# EasyEDA Pro project parallel_trans.eprj

# Schematic Schematic1
Board Name: Board1; Create Date: 2025-04-26; Page Name: P1; Project Name: parallel_trans; Schematic Name: Schematic1; Update Date: 2025-06-30; Company: 嘉立创EDA; Page Size: A4; Version: V1.0
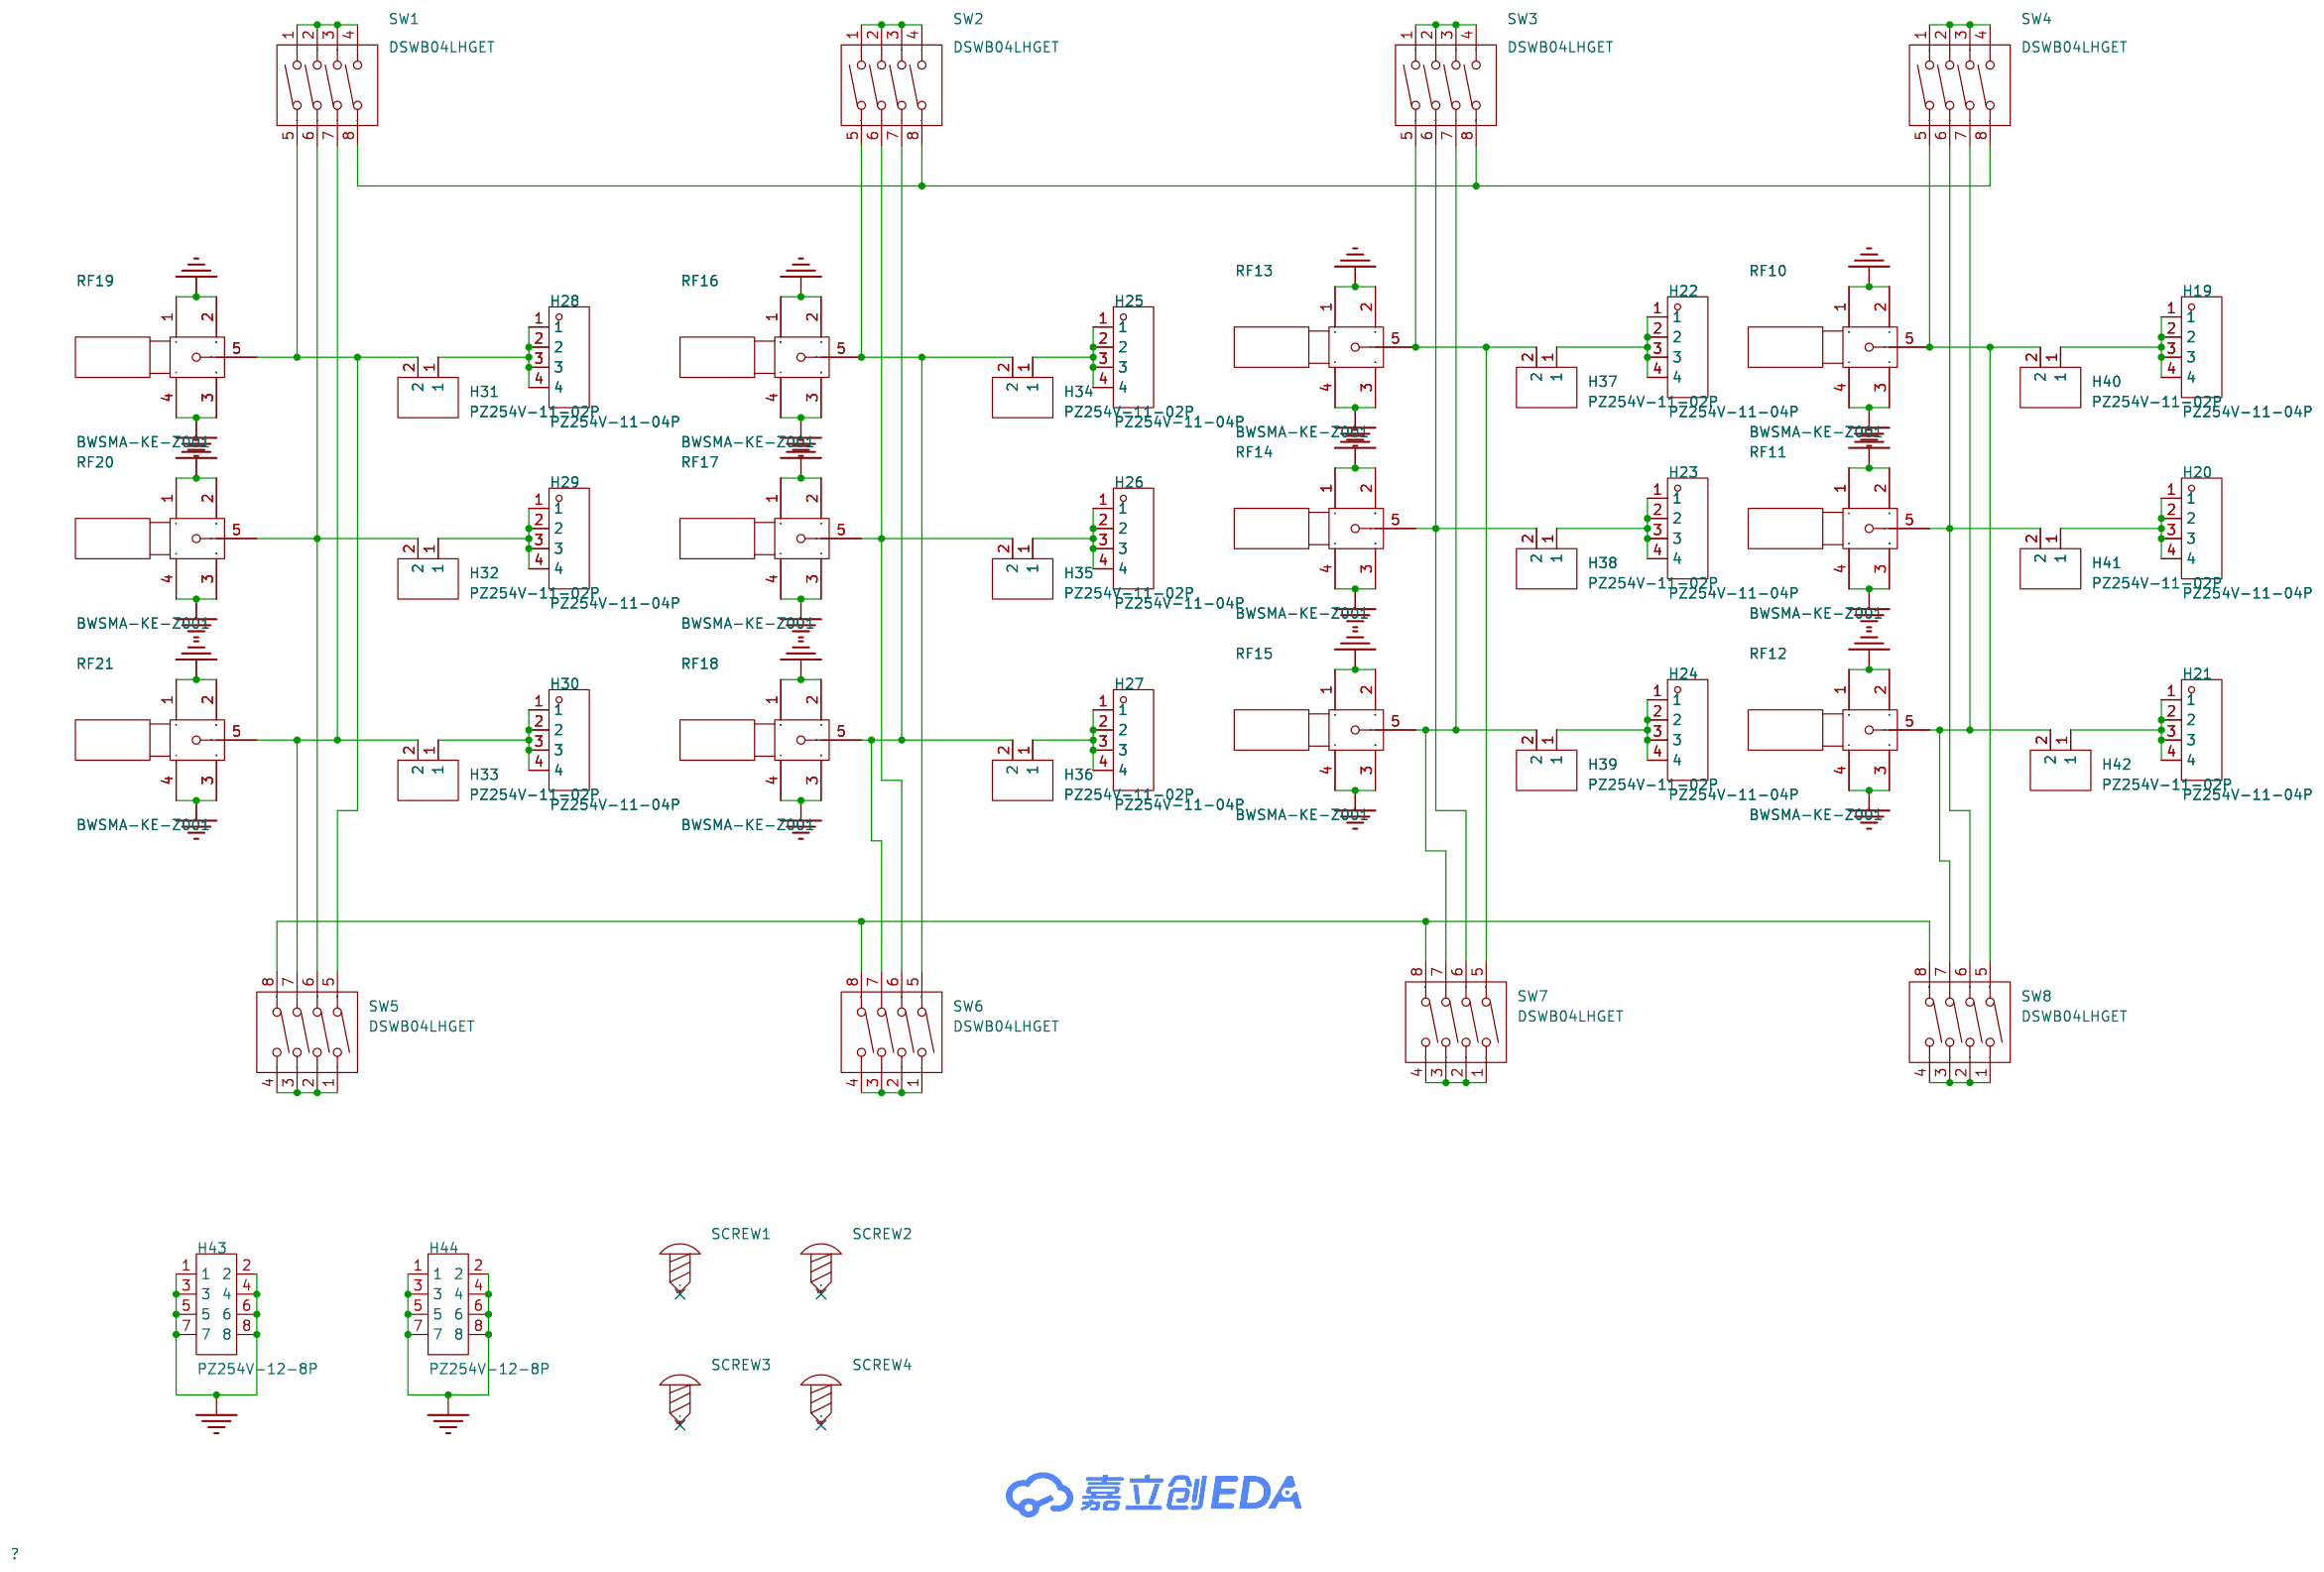
[diagram p0: schematic sheet]

## Parts
H19  PZ254V-11-04P  [HDR-TH_4P-P2.54-V-M]
H20  PZ254V-11-04P  [HDR-TH_4P-P2.54-V-M]
H21  PZ254V-11-04P  [HDR-TH_4P-P2.54-V-M]
H22  PZ254V-11-04P  [HDR-TH_4P-P2.54-V-M]
H23  PZ254V-11-04P  [HDR-TH_4P-P2.54-V-M]
H24  PZ254V-11-04P  [HDR-TH_4P-P2.54-V-M]
H25  PZ254V-11-04P  [HDR-TH_4P-P2.54-V-M]
H26  PZ254V-11-04P  [HDR-TH_4P-P2.54-V-M]
H27  PZ254V-11-04P  [HDR-TH_4P-P2.54-V-M]
H28  PZ254V-11-04P  [HDR-TH_4P-P2.54-V-M]
H29  PZ254V-11-04P  [HDR-TH_4P-P2.54-V-M]
H30  PZ254V-11-04P  [HDR-TH_4P-P2.54-V-M]
H31  PZ254V-11-02P  [HDR-TH_2P-P2.54-V-M]
H32  PZ254V-11-02P  [HDR-TH_2P-P2.54-V-M]
H33  PZ254V-11-02P  [HDR-TH_2P-P2.54-V-M]
H34  PZ254V-11-02P  [HDR-TH_2P-P2.54-V-M]
H35  PZ254V-11-02P  [HDR-TH_2P-P2.54-V-M]
H36  PZ254V-11-02P  [HDR-TH_2P-P2.54-V-M]
H37  PZ254V-11-02P  [HDR-TH_2P-P2.54-V-M]
H38  PZ254V-11-02P  [HDR-TH_2P-P2.54-V-M]
H39  PZ254V-11-02P  [HDR-TH_2P-P2.54-V-M]
H40  PZ254V-11-02P  [HDR-TH_2P-P2.54-V-M]
H41  PZ254V-11-02P  [HDR-TH_2P-P2.54-V-M]
H42  PZ254V-11-02P  [HDR-TH_2P-P2.54-V-M]
H43  PZ254V-12-8P  [HDR-TH_8P-P2.54-V-M-R2-C4-S2.54]
H44  PZ254V-12-8P  [HDR-TH_8P-P2.54-V-M-R2-C4-S2.54]
RF10  BWSMA-KE-Z001  [SMA-TH_BWSMA-KE-Z001]
RF11  BWSMA-KE-Z001  [SMA-TH_BWSMA-KE-Z001]
RF12  BWSMA-KE-Z001  [SMA-TH_BWSMA-KE-Z001]
RF13  BWSMA-KE-Z001  [SMA-TH_BWSMA-KE-Z001]
RF14  BWSMA-KE-Z001  [SMA-TH_BWSMA-KE-Z001]
RF15  BWSMA-KE-Z001  [SMA-TH_BWSMA-KE-Z001]
RF16  BWSMA-KE-Z001  [SMA-TH_BWSMA-KE-Z001]
RF17  BWSMA-KE-Z001  [SMA-TH_BWSMA-KE-Z001]
RF18  BWSMA-KE-Z001  [SMA-TH_BWSMA-KE-Z001]
RF19  BWSMA-KE-Z001  [SMA-TH_BWSMA-KE-Z001]
RF20  BWSMA-KE-Z001  [SMA-TH_BWSMA-KE-Z001]
RF21  BWSMA-KE-Z001  [SMA-TH_BWSMA-KE-Z001]
SCREW1  -  [M3螺丝]
SCREW2  -  [M3螺丝]
SCREW3  -  [M3螺丝]
SCREW4  -  [M3螺丝]
SW1  DSWB04LHGET  [SW-TH_DSWB04LHGET]
SW2  DSWB04LHGET  [SW-TH_DSWB04LHGET]
SW3  DSWB04LHGET  [SW-TH_DSWB04LHGET]
SW4  DSWB04LHGET  [SW-TH_DSWB04LHGET]
SW5  DSWB04LHGET  [SW-TH_DSWB04LHGET]
SW6  DSWB04LHGET  [SW-TH_DSWB04LHGET]
SW7  DSWB04LHGET  [SW-TH_DSWB04LHGET]
SW8  DSWB04LHGET  [SW-TH_DSWB04LHGET]

## Library data of the parts
H19-H30 = PZ254V-11-04P: LCSC Part Name: 间距:2.54mm 1x4P 直插 方针; Supplier Part: C2691448; Manufacturer: XFCN(兴飞); Supplier Footprint: 插件,P=2.54mm; JLCPCB Part Class: 扩展库; Datasheet: https://atta.szlcsc.com/upload/public/pdf/source/20200309/C492403_F9F19131791D08044AD4F84F8E751A34.pdf; Supplier: LCSC; Pin Structure: 1x4P; Pitch: 2.54mm; Circluar Pins/Square Pins: 方针; Mounting Type: 直插; Number of Rows: 单排; Number of Pins: 4P; Current Rating (Max): 3A; Voltage Rating (Max): 250V; Length of Mating Pin: 6mm; Insulation Height: 2.5mm; Length of End Connection Pin: 3mm; Operating Temperature Range: -40℃~+105℃; Color: 黑色
H31-H42 = PZ254V-11-02P: LCSC Part Name: 1x2P 间距:2.54mm 方针 直插; Supplier Part: C492401; Manufacturer: XFCN(兴飞); Supplier Footprint: 插件,P=2.54mm; JLCPCB Part Class: 扩展库; Datasheet: https://atta.szlcsc.com/upload/public/pdf/source/20200309/C492401_A812433581A9B211A7FFA413ADDFF0E5.pdf; Supplier: LCSC; Pin Structure: 1x2P; Pitch: 2.54mm; Circluar Pins/Square Pins: 方针; Mounting Type: 直插; Number of Rows: 单排; Number of Pins: 2P; Length of Mating Pin: 6mm; Insulation Height: 2.5mm; Length of End Connection Pin: 3mm; Contact Material: 黄铜; Operating Temperature: -40℃~+105℃; Color: 黑色
H43 H44 = PZ254V-12-8P: LCSC Part Name: 2x4P 间距:2.54mm 方针 直插; Supplier Part: C492421; Manufacturer: XFCN(兴飞); Supplier Footprint: 插件,P=2.54mm; JLCPCB Part Class: 扩展库; Datasheet: https://atta.szlcsc.com/upload/public/pdf/source/20200309/C492421_DC8A206AF99CD7755BD4A5B0BC48200B.pdf; Supplier: LCSC; Pin Structure: 2x4P; Pitch: 2.54mm; Row Spacing: 2.54mm; Circluar Pins/Square Pins: 方针; Mounting Type: 直插; Number of Rows: 双排; Number of Pins: 8P; Length of Mating Pin: 6mm; Insulation Height: 2.5mm; Length of End Connection Pin: 3mm; Contact Material: 黄铜; Operating Temperature: -40℃~+105℃; Color: 黑色
RF10-RF21 = BWSMA-KE-Z001_C496549: LCSC Part Name: 内孔 SMA 正脚; Supplier Part: C496549; Manufacturer: BAT WIRELESS(蝙蝠无线); Supplier Footprint: 插件; JLCPCB Part Class: 扩展库; Datasheet: https://atta.szlcsc.com/upload/public/pdf/source/20221228/40BF41E56A06003A0210E1785CA66EA6.pdf; Supplier: LCSC; Connector Type: 板端; Interface Type: 内孔; Number of Ports: 1; RF Series: SMA; Impedance: 50Ω; Style: 正脚; Operating Temperature Range: -65℃~+165℃
SCREW1-SCREW4 = M3螺丝: Supplier Footprint: 插件
SW1-SW8 = DSWB04LHGET: LCSC Part Name: 间距2.54mm 平拨,凸起式 4位拨码开关; Supplier Part: C99418; Manufacturer: YE; Supplier Footprint: 插件; JLCPCB Part Class: 扩展库; Datasheet: https://atta.szlcsc.com/upload/public/pdf/source/20220830/02827E67A8727938D957A3CE4C86C92D.pdf; Supplier: LCSC; Type: 平拨,凸起式; Circuit: 单刀单掷; Number of Positions: 4位; Lead Pitch: 2.54mm; Color: 红色

## Nets
GND: H43.1 H43.2 H43.3 H43.4 H43.5 H43.6 H43.7 H43.8 H44.1 H44.2 H44.3 H44.4 H44.5 H44.6 H44.7 H44.8 RF10.1 RF10.2 RF10.3 RF10.4 RF11.1 RF11.2 RF11.3 RF11.4 RF12.1 RF12.2 RF12.3 RF12.4 RF13.1 RF13.2 RF13.3 RF13.4 RF14.1 RF14.2 RF14.3 RF14.4 RF15.1 RF15.2 RF15.3 RF15.4 RF16.1 RF16.2 RF16.3 RF16.4 RF17.1 RF17.2 RF17.3 RF17.4 RF18.1 RF18.2 RF18.3 RF18.4 RF19.1 RF19.2 RF19.3 RF19.4 RF20.1 RF20.2 RF20.3 RF20.4 RF21.1 RF21.2 RF21.3 RF21.4
$1N5094: H31.2 RF19.5 SW1.5 SW5.5
$1N5101: H28.1 H28.2 H28.3 H28.4 H31.1
$1N5308: H21.1 H21.2 H21.3 H21.4 H42.1
$1N5332: H32.2 RF20.5 SW1.6 SW5.6
$1N5339: H29.1 H29.2 H29.3 H29.4 H32.1
$1N5344: H33.2 RF21.5 SW1.7 SW5.7
$1N5351: H30.1 H30.2 H30.3 H30.4 H33.1
$1N5356: H34.2 RF16.5 SW2.5 SW6.5
$1N5363: H25.1 H25.2 H25.3 H25.4 H34.1
$1N5368: H35.2 RF17.5 SW2.6 SW6.6
$1N5375: H26.1 H26.2 H26.3 H26.4 H35.1
$1N5380: H36.2 RF18.5 SW2.7 SW6.7
$1N5387: H27.1 H27.2 H27.3 H27.4 H36.1
$1N5392: H37.2 RF13.5 SW3.5 SW7.5
$1N5399: H22.1 H22.2 H22.3 H22.4 H37.1
$1N5404: H38.2 RF14.5 SW3.6 SW7.6
$1N5411: H23.1 H23.2 H23.3 H23.4 H38.1
$1N5416: H39.2 RF15.5 SW3.7 SW7.7
$1N5423: H24.1 H24.2 H24.3 H24.4 H39.1
$1N5428: H40.2 RF10.5 SW4.5 SW8.5
$1N5435: H19.1 H19.2 H19.3 H19.4 H40.1
$1N5440: H41.2 RF11.5 SW4.6 SW8.6
$1N5447: H20.1 H20.2 H20.3 H20.4 H41.1
$1N5451: H42.2 RF12.5 SW4.7 SW8.7
$1N5611: SW1.1 SW1.2 SW1.3 SW1.4
$1N5632: SW2.1 SW2.2 SW2.3 SW2.4
$1N5654: SW3.1 SW3.2 SW3.3 SW3.4
$1N5702: SW1.8 SW2.8 SW3.8 SW4.8
$1N5734: SW4.1 SW4.2 SW4.3 SW4.4
$1N8243: SW5.1 SW5.2 SW5.3 SW5.4
$1N8264: SW6.1 SW6.2 SW6.3 SW6.4
$1N8286: SW7.1 SW7.2 SW7.3 SW7.4
$1N8697: SW8.1 SW8.2 SW8.3 SW8.4
$1N8799: SW5.8 SW6.8 SW7.8 SW8.8

Not connected (* = marked no-connect by the designer): SCREW1 1*; SCREW2 1*; SCREW3 1*; SCREW4 1*

# Board PCB3
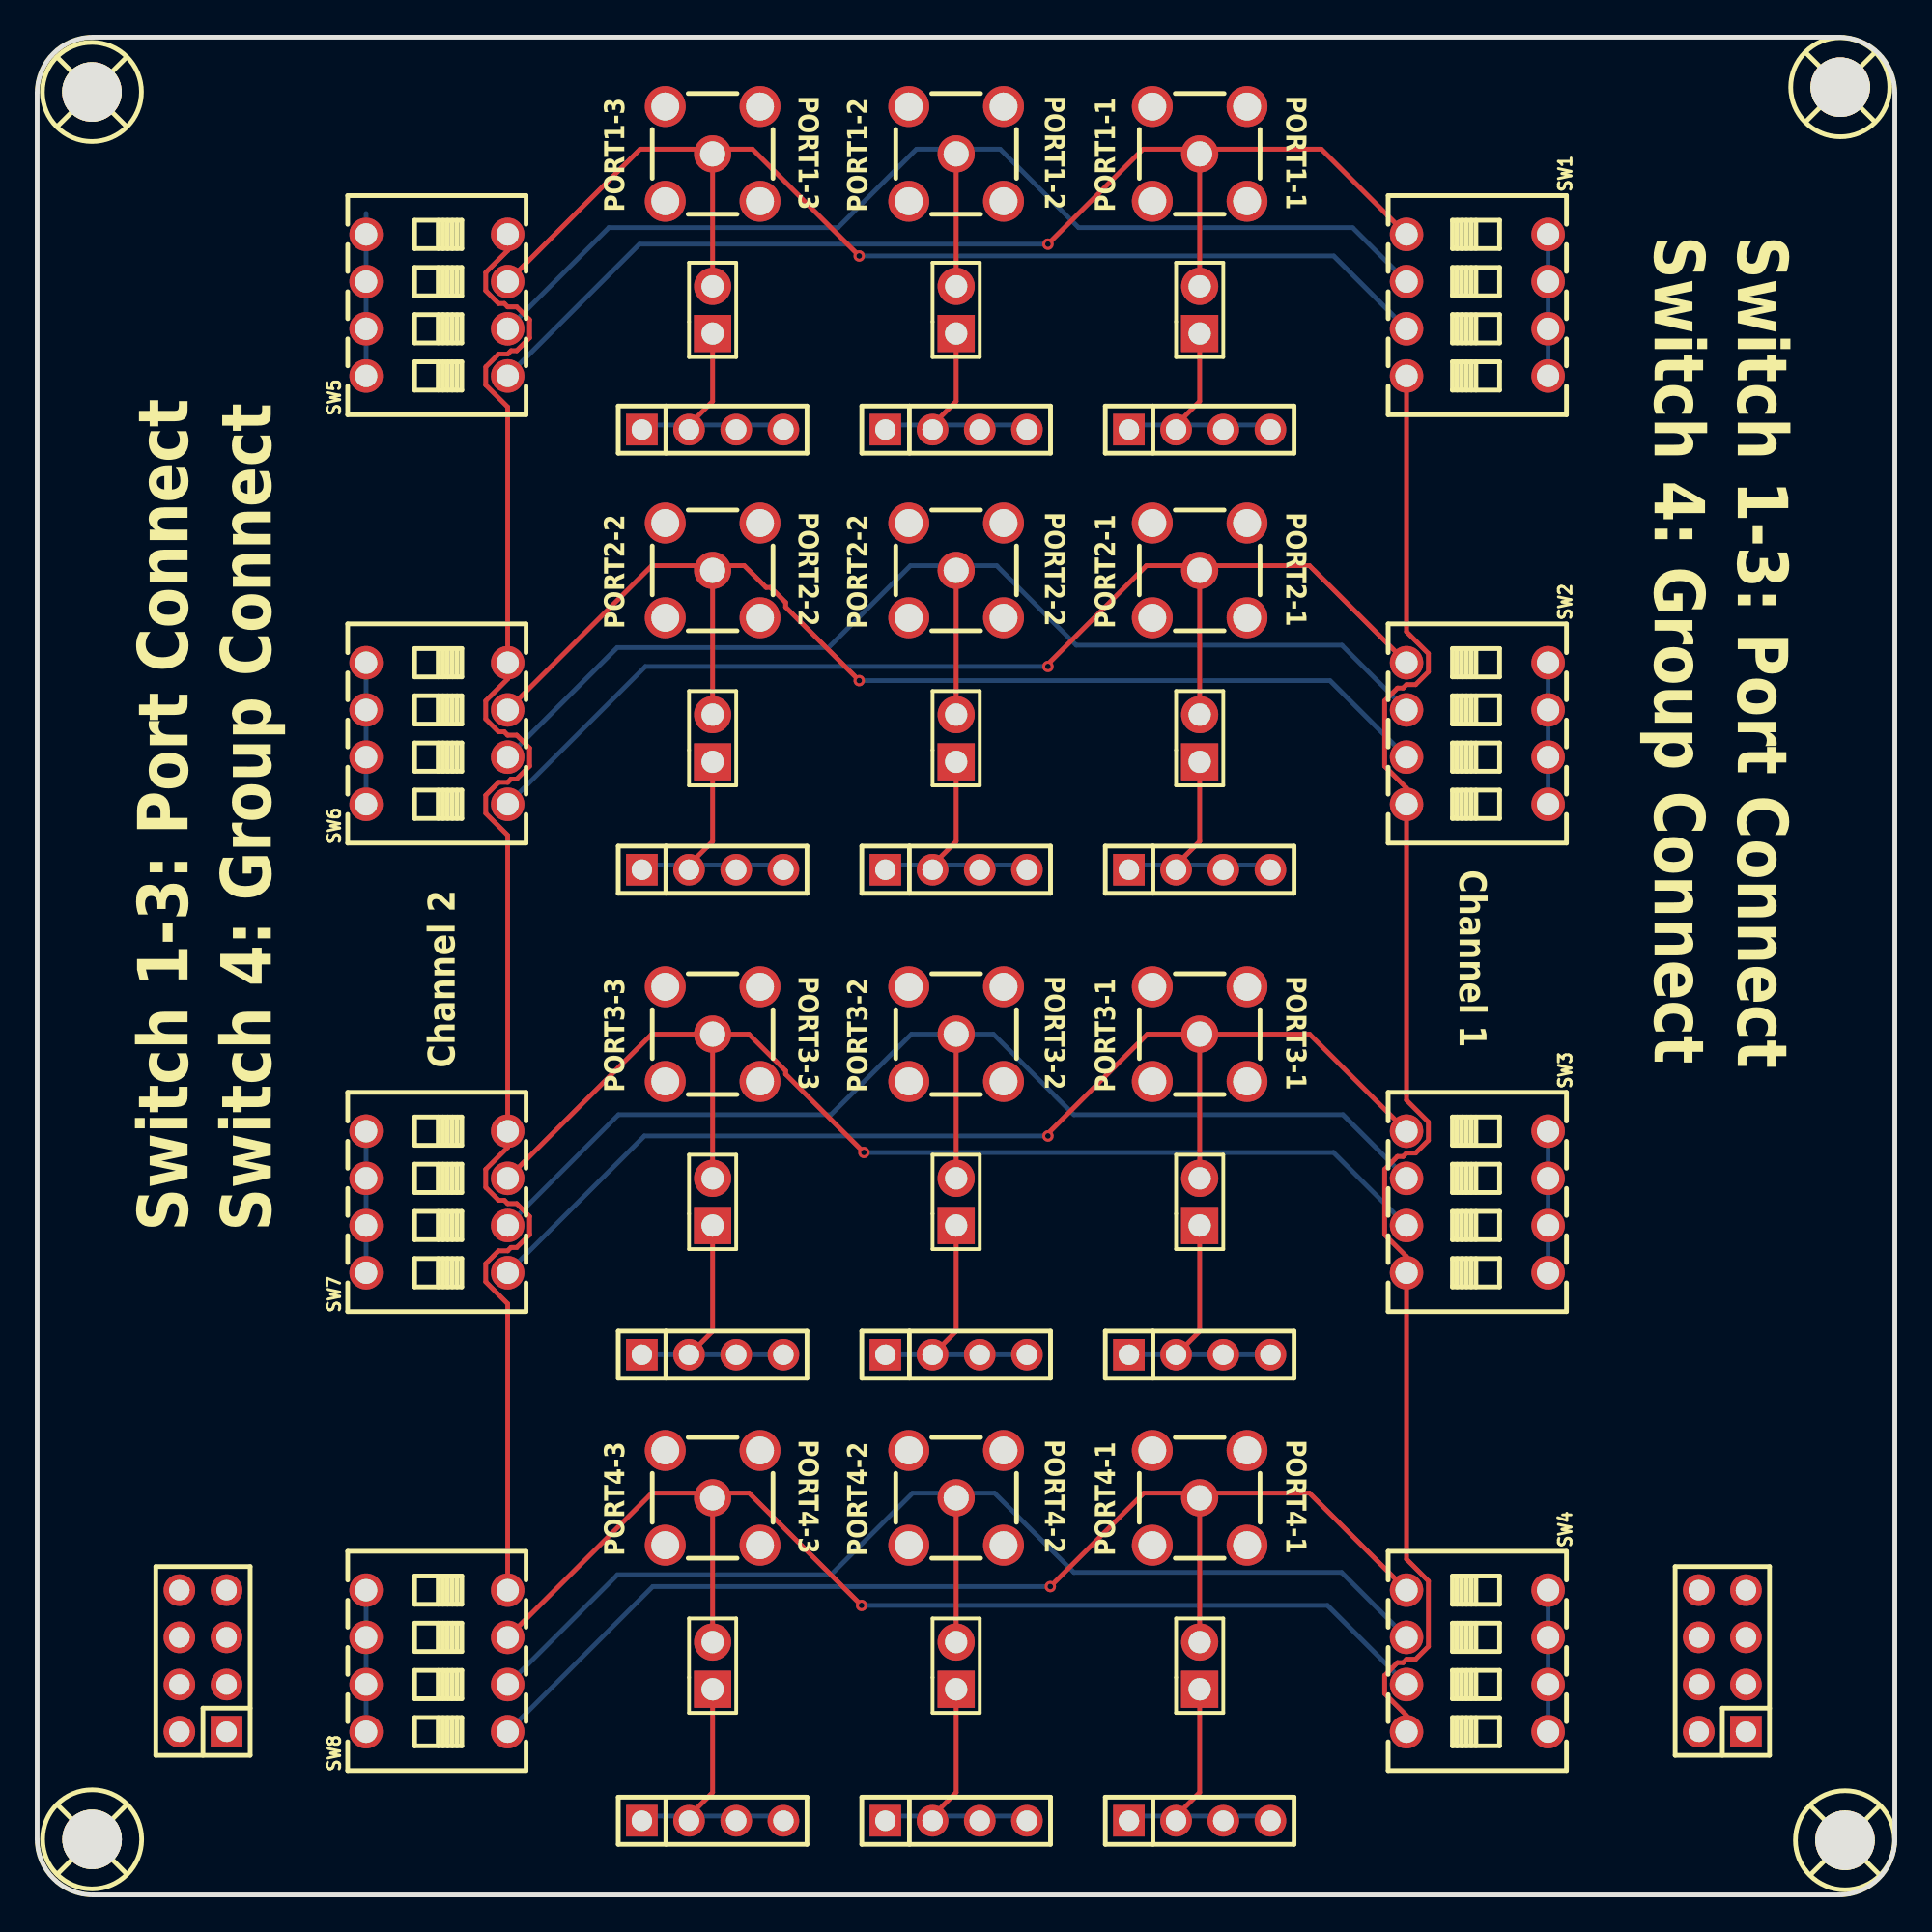
[diagram p1: board, top side]
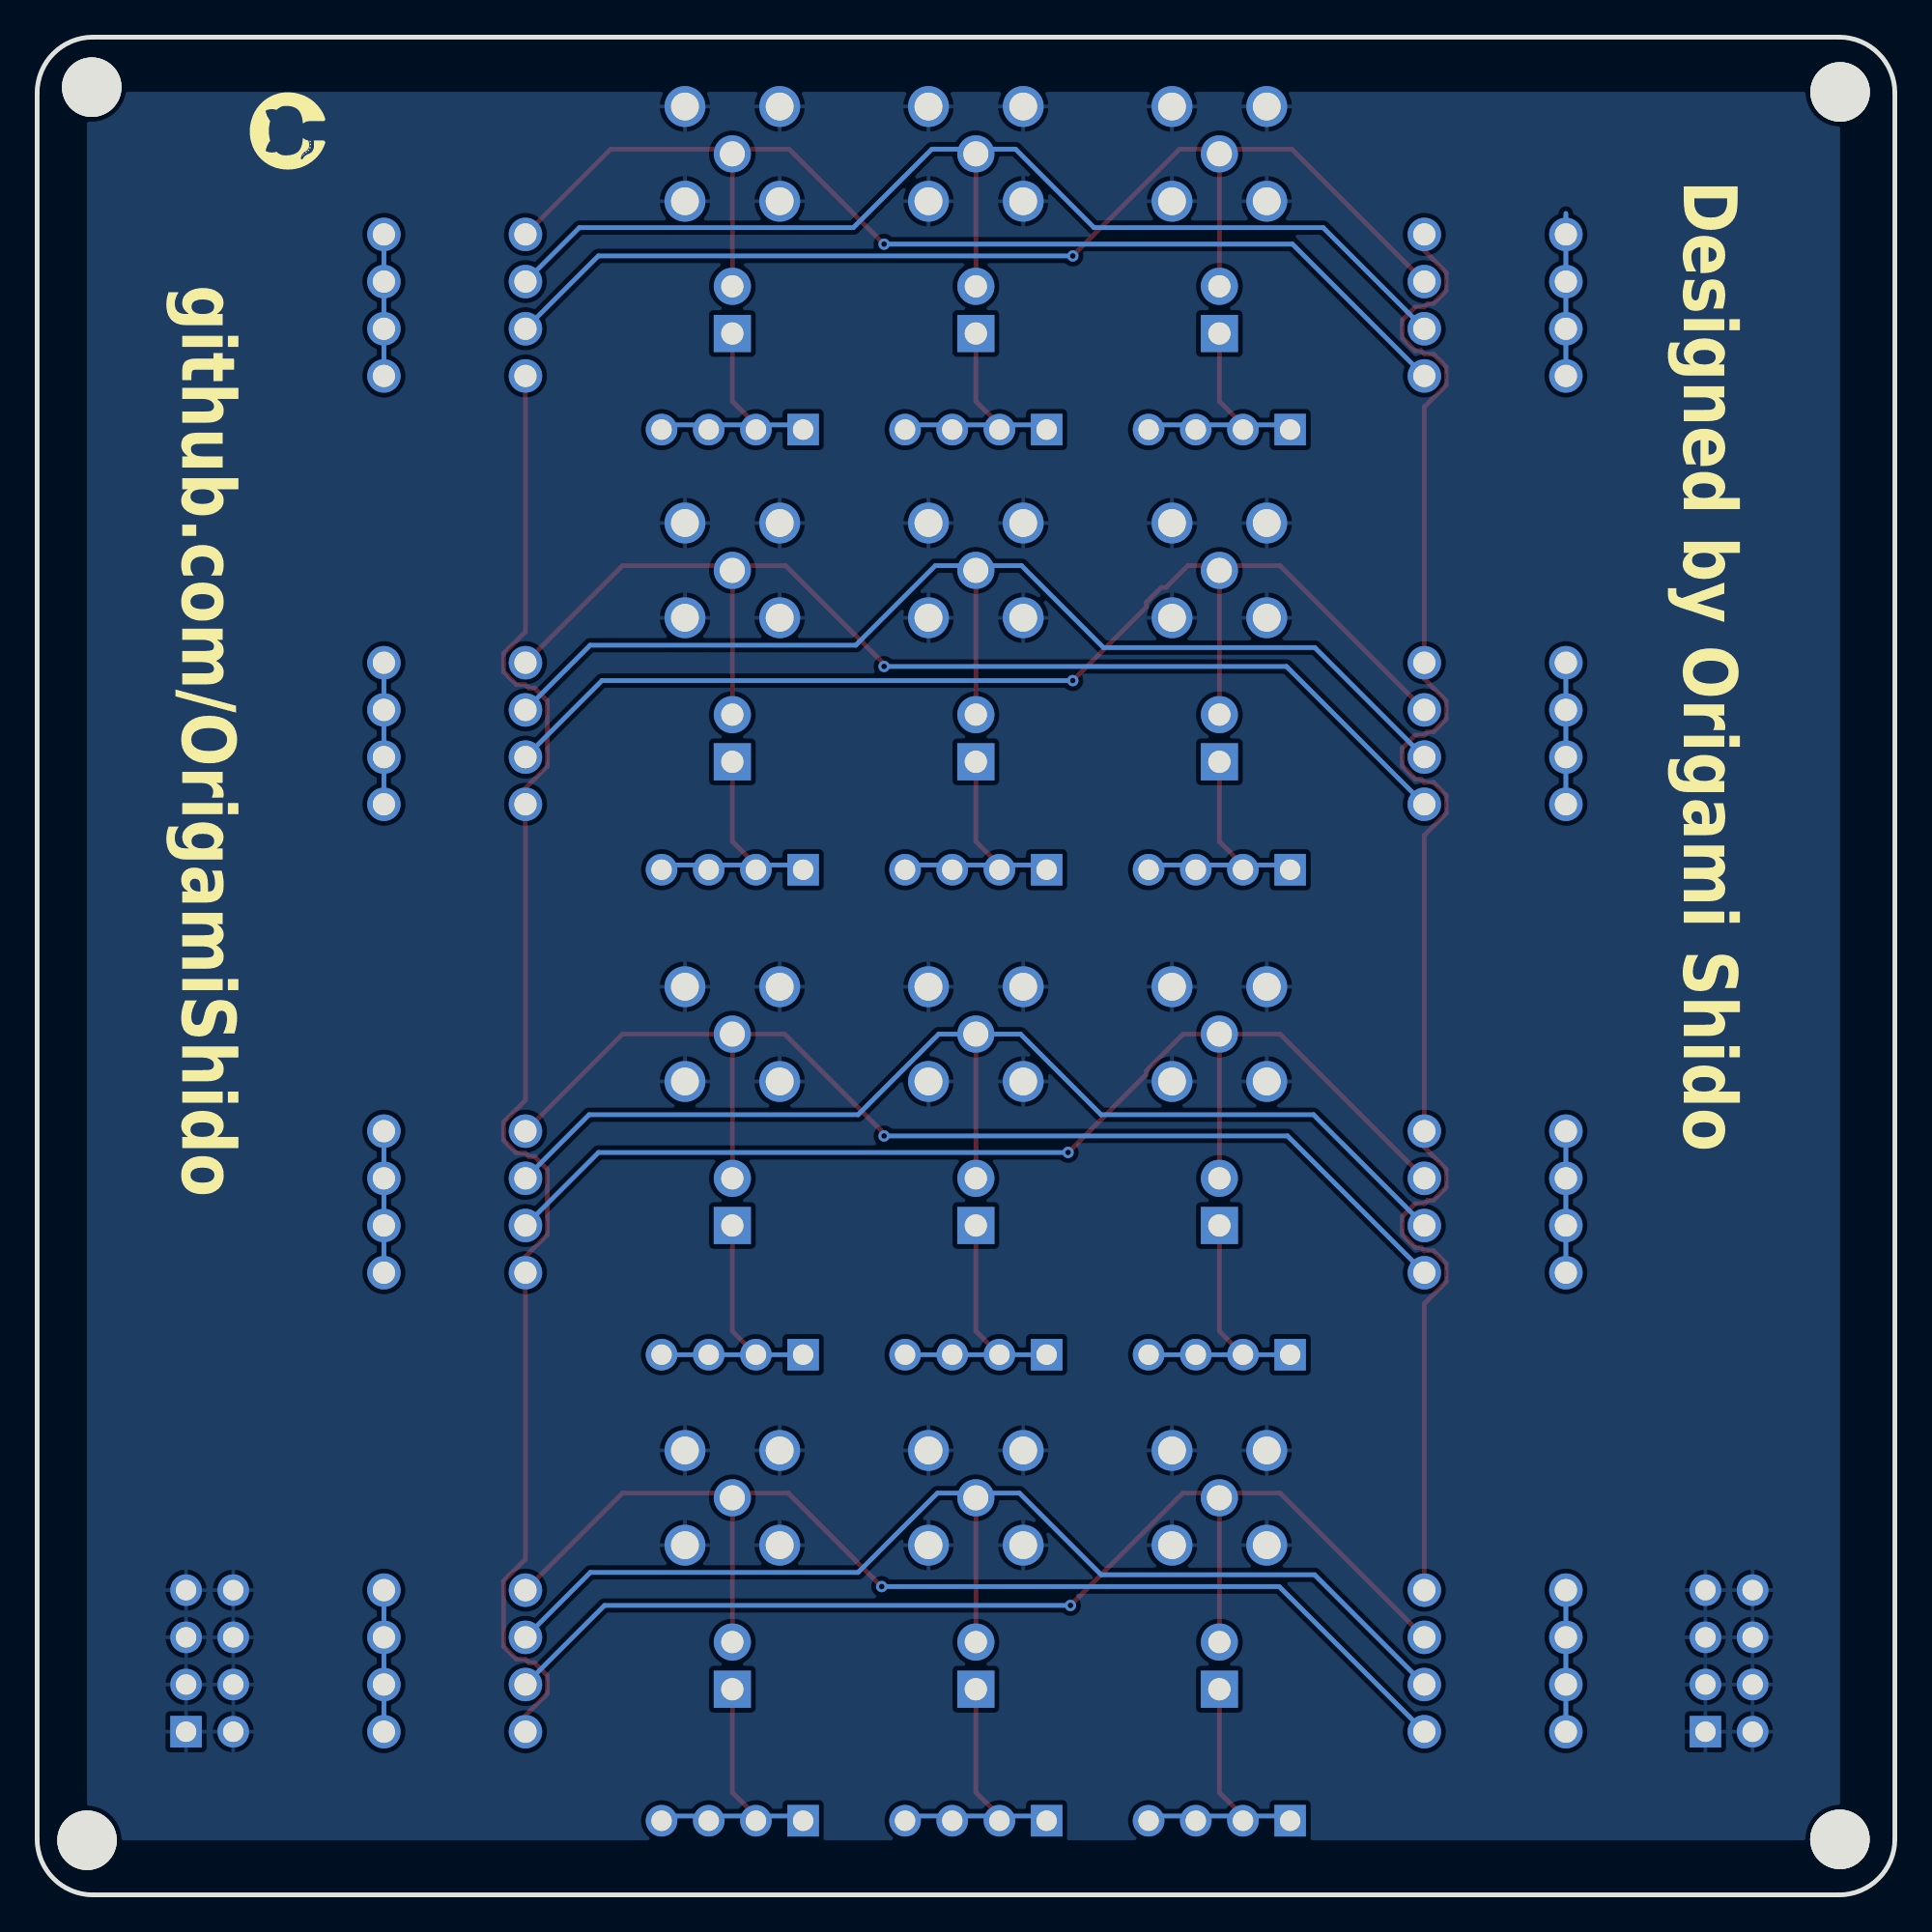
[diagram p2: board, bottom side, seen from below]

Outline 100 x 100 mm; copper layers: Top Layer, Bottom Layer. Coordinates in mm from the lower left corner of the outline.
Outline path: 0,97 0,3 arc(0.88,0.88) 3,0 97,0 arc(99.12,0.88) 100,3 100,97 arc(99.12,99.12) 97,100 3,100 arc(0.88,99.12) 0,97
Stack: Top Layer 0.035mm / Dielectric1 1.51mm FR4 er 4.5 / Bottom Layer 0.035mm

## Design rules (mm)
template: JLCPCB Capability(Two Layers Board)
spacing copperThickness1oz (default): track to track 0.102, other pairs 0.152 to 0.3
spacing copperThickness2oz: track to track 0.203, other pairs 0.152 to 0.3
track width copperThickness1oz (default): min 0.127, default 0.254, max 2.54
track width copperThickness2oz: min 0.203, default 0.254, max 2.54
differential pair differentialPair (default): width min 0.127, default 0.254, max 2.54; gap min 0.152, default 0.152
via viaSize (default): diameter min 0.5, default 0.61, max 10; hole min 0.3, default 0.305, max 6.3

## Placement (name value [footprint] x y rotation side)
H19  PZ254V-11-04P  [HDR-TH_4P-P2.54-V-M]  62.58 3.99 0 top
H20  PZ254V-11-04P  [HDR-TH_4P-P2.54-V-M]  49.47 3.99 0 top
H21  PZ254V-11-04P  [HDR-TH_4P-P2.54-V-M]  36.36 3.99 0 top
H22  PZ254V-11-04P  [HDR-TH_4P-P2.54-V-M]  62.58 29.08 0 top
H23  PZ254V-11-04P  [HDR-TH_4P-P2.54-V-M]  49.47 29.08 0 top
H24  PZ254V-11-04P  [HDR-TH_4P-P2.54-V-M]  36.36 29.08 0 top
H25  PZ254V-11-04P  [HDR-TH_4P-P2.54-V-M]  62.58 55.18 0 top
H26  PZ254V-11-04P  [HDR-TH_4P-P2.54-V-M]  49.47 55.18 0 top
H27  PZ254V-11-04P  [HDR-TH_4P-P2.54-V-M]  36.36 55.18 0 top
H28  PZ254V-11-04P  [HDR-TH_4P-P2.54-V-M]  62.58 78.87 0 top
H29  PZ254V-11-04P  [HDR-TH_4P-P2.54-V-M]  49.47 78.87 0 top
H30  PZ254V-11-04P  [HDR-TH_4P-P2.54-V-M]  36.36 78.87 0 top
H31  PZ254V-11-02P  [HDR-TH_2P-P2.54-V-M]  62.58 85.32 90 top
H32  PZ254V-11-02P  [HDR-TH_2P-P2.54-V-M]  49.47 85.32 90 top
H33  PZ254V-11-02P  [HDR-TH_2P-P2.54-V-M]  36.36 85.32 90 top
H34  PZ254V-11-02P  [HDR-TH_2P-P2.54-V-M]  62.58 62.26 90 top
H35  PZ254V-11-02P  [HDR-TH_2P-P2.54-V-M]  49.47 62.26 90 top
H36  PZ254V-11-02P  [HDR-TH_2P-P2.54-V-M]  36.36 62.26 90 top
H37  PZ254V-11-02P  [HDR-TH_2P-P2.54-V-M]  62.58 37.3 90 top
H38  PZ254V-11-02P  [HDR-TH_2P-P2.54-V-M]  49.47 37.3 90 top
H39  PZ254V-11-02P  [HDR-TH_2P-P2.54-V-M]  36.36 37.3 90 top
H40  PZ254V-11-02P  [HDR-TH_2P-P2.54-V-M]  62.58 12.34 90 top
H41  PZ254V-11-02P  [HDR-TH_2P-P2.54-V-M]  49.47 12.34 90 top
H42  PZ254V-11-02P  [HDR-TH_2P-P2.54-V-M]  36.36 12.34 90 top
H43  PZ254V-12-8P  [HDR-TH_8P-P2.54-V-M-R2-C4-S2.54]  90.71 12.59 90 top
H44  PZ254V-12-8P  [HDR-TH_8P-P2.54-V-M-R2-C4-S2.54]  8.93 12.59 90 top
RF10  BWSMA-KE-Z001  [SMA-TH_BWSMA-KE-Z001]  62.58 21.37 270 top
RF11  BWSMA-KE-Z001  [SMA-TH_BWSMA-KE-Z001]  49.47 21.37 270 top
RF12  BWSMA-KE-Z001  [SMA-TH_BWSMA-KE-Z001]  36.36 21.37 270 top
RF13  BWSMA-KE-Z001  [SMA-TH_BWSMA-KE-Z001]  62.58 46.33 270 top
RF14  BWSMA-KE-Z001  [SMA-TH_BWSMA-KE-Z001]  49.47 46.33 270 top
RF15  BWSMA-KE-Z001  [SMA-TH_BWSMA-KE-Z001]  36.36 46.33 270 top
RF16  BWSMA-KE-Z001  [SMA-TH_BWSMA-KE-Z001]  62.58 71.3 270 top
RF17  BWSMA-KE-Z001  [SMA-TH_BWSMA-KE-Z001]  49.47 71.3 270 top
RF18  BWSMA-KE-Z001  [SMA-TH_BWSMA-KE-Z001]  36.36 71.3 270 top
RF19  BWSMA-KE-Z001  [SMA-TH_BWSMA-KE-Z001]  62.58 93.72 270 top
RF20  BWSMA-KE-Z001  [SMA-TH_BWSMA-KE-Z001]  49.47 93.72 270 top
RF21  BWSMA-KE-Z001  [SMA-TH_BWSMA-KE-Z001]  36.36 93.72 270 top
SCREW1  -  [M3螺丝]  2.96 2.99 0 top
SCREW2  -  [M3螺丝]  97.32 2.94 0 top
SCREW3  -  [M3螺丝]  97.06 97.31 0 top
SCREW4  -  [M3螺丝]  2.95 97.05 0 top
SW1  DSWB04LHGET  [SW-TH_DSWB04LHGET]  77.52 85.57 270 top
SW2  DSWB04LHGET  [SW-TH_DSWB04LHGET]  77.52 62.52 270 top
SW3  DSWB04LHGET  [SW-TH_DSWB04LHGET]  77.52 37.3 270 top
SW4  DSWB04LHGET  [SW-TH_DSWB04LHGET]  77.52 12.59 270 top
SW5  DSWB04LHGET  [SW-TH_DSWB04LHGET]  21.52 85.57 90 top
SW6  DSWB04LHGET  [SW-TH_DSWB04LHGET]  21.52 62.52 90 top
SW7  DSWB04LHGET  [SW-TH_DSWB04LHGET]  21.52 37.3 90 top
SW8  DSWB04LHGET  [SW-TH_DSWB04LHGET]  21.52 12.59 90 top

## Footprints (pads in the part's own frame, mm; a bottom-side part is the same pattern mirrored in y, then rotated)
HDR-TH_2P-P2.54-V-M
  rect 2x2 hole 1.2: 1(-1.27,0)
  round 2 hole 1.2: 2(1.27,0)
HDR-TH_4P-P2.54-V-M
  rect 1.7x1.7 hole 1.1: 1(-3.81,0)
  round 1.7 hole 1.1: 2(-1.27,0) 3(1.27,0) 4(3.81,0)
HDR-TH_8P-P2.54-V-M-R2-C4-S2.54
  rect 1.7x1.7 hole 1.1: 1(-3.81,-1.27)
  round 1.7 hole 1.1: 2(-3.81,1.27) 3(-1.27,-1.27) 4(-1.27,1.27) 5(1.27,-1.27) 6(1.27,1.27) 7(3.81,-1.27) 8(3.81,1.27)
M3螺丝
  round 3.2 hole 3.2: 1(0,0)
SMA-TH_BWSMA-KE-Z001
  round 2.2 hole 1.5: 1(-2.55,-2.55) 2(-2.55,2.55) 3(2.55,2.55) 4(2.55,-2.55)
  round 2 hole 1.35: 5(0,0)
SW-TH_DSWB04LHGET
  round 1.8 hole 1.2: 1(-3.81,3.81) 2(-1.27,3.81) 3(1.27,3.81) 4(3.81,3.81) 5(-3.81,-3.81) 6(-1.27,-3.81) 7(1.27,-3.81) 8(3.81,-3.81)

## Nets
As in the schematic.

Pads without a net: SCREW1 1; SCREW2 1; SCREW3 1; SCREW4 1

## Via types
v1: diameter 0.61, hole 0.305, Top Layer to Bottom Layer, 8 vias

## Routing (per net, layer and track width the routed paths; a pad name or vN(x,y) marks a point on that pad's centre or on a via; arc(x,y) is an arc through that point)
$1N5094: length 62.5
  Top Layer w0.254: 62.58,93.97 69.13,93.97 SW1.5 ; 62.58,93.97 62.58,86.84 ; 62.58,93.97 59.52,93.97 v1(54.41,88.86)
  Bottom Layer w0.254: SW5.5 32.42,88.86 v1(54.41,88.86)
$1N5101: length 13.3
  Top Layer w0.254: 62.58,84.3 62.58,80.4 61.31,79.13
  Bottom Layer w0.254: 66.39,79.13 58.77,79.13
$1N5308: length 15.2
  Top Layer w0.254: 35.09,4.24 36.36,5.51 36.36,11.32
  Bottom Layer w0.254: 40.17,4.24 32.55,4.24
$1N5332: length 62.5
  Top Layer w0.254: 49.47,93.97 49.47,86.84
  Bottom Layer w0.254: SW1.6 70.81,89.75 56.06,89.75 51.84,93.97 47.33,93.97 43.11,89.75 30.77,89.75 SW5.6
$1N5339: length 13.3
  Top Layer w0.254: 48.2,79.13 49.47,80.4 49.47,84.3
  Bottom Layer w0.254: 53.28,79.13 45.66,79.13
$1N5344: length 62.5
  Top Layer w0.254: v1(44.25,88.22) 38.5,93.97 36.36,93.97 ; 36.36,93.97 36.36,86.84 ; 36.36,93.97 32.46,93.97 SW5.7
  Bottom Layer w0.254: SW1.7 69.79,88.22 v1(44.25,88.22)
$1N5351: length 13.3
  Top Layer w0.254: 36.36,84.3 36.36,80.4 35.09,79.13
  Bottom Layer w0.254: 40.17,79.13 32.55,79.13
$1N5356: length 63.6
  Top Layer w0.254: 62.58,71.55 59.71,71.55 54.28,66.12 ; 62.58,71.55 62.58,63.79 ; 62.58,71.55 68.49,71.55 SW2.5
  Bottom Layer w0.254: 54.28,66.12 32.75,66.12 SW6.5
  vias: v1(54.41,66.12)
$1N5363: length 14
  Top Layer w0.254: 62.58,61.25 62.58,56.71 61.31,55.44
  Bottom Layer w0.254: 66.39,55.44 58.77,55.44
$1N5368: length 63.6
  Top Layer w0.254: 49.47,71.55 49.47,63.79
  Bottom Layer w0.254: SW6.6 31.22,67.14 42.6,67.14 47.01,71.55 51.65,71.55 55.93,67.27 70.23,67.27 SW2.6
$1N5375: length 14
  Top Layer w0.254: 49.47,61.25 49.47,56.71 48.2,55.44
  Bottom Layer w0.254: 53.28,55.44 45.66,55.44
$1N5380: length 63.8
  Top Layer w0.254: 36.36,71.55 38.06,71.55 39.24,70.38 39.48,70.38 40.29,69.57 40.29,69.32 v1(44.25,65.36) ; 36.36,71.55 36.36,63.79 ; 36.36,71.55 33.09,71.55 SW6.7
  Bottom Layer w0.254: v1(44.25,65.36) 69.6,65.36 SW2.7
$1N5387: length 14
  Top Layer w0.254: 36.36,61.25 36.36,56.71 35.09,55.44
  Bottom Layer w0.254: 40.17,55.44 32.55,55.44
$1N5392: length 63.6
  Top Layer w0.254: RF13.5 H37.2 ; RF13.5 68.49,46.33 SW3.5 ; RF13.5 59.77,46.33 54.28,40.85
  Bottom Layer w0.254: SW7.5 32.69,40.85 54.28,40.85
  vias: v1(54.41,40.85)
$1N5399: length 15.1
  Top Layer w0.254: H22.2 62.58,30.35 H37.1
  Bottom Layer w0.254: H22.1 H22.2 H22.3 H22.4
$1N5404: length 63.6
  Top Layer w0.254: RF14.5 H38.2
  Bottom Layer w0.254: SW7.6 31.29,41.99 42.73,41.99 47.07,46.33 RF14.5 51.47,46.33 55.81,41.99 70.29,41.99 SW3.6
$1N5411: length 15.1
  Top Layer w0.254: H38.1 49.47,30.35 H23.2
  Bottom Layer w0.254: H23.1 H23.2 H23.3 H23.4
$1N5416: length 63.7
  Top Layer w0.254: SW7.7 33.09,46.33 RF15.5 ; RF15.5 38.31,46.33 40.29,44.35 40.29,44.18 v1(44.51,39.96) ; RF15.5 H39.2
  Bottom Layer w0.254: v1(44.51,39.96) 69.78,39.96 SW3.7
$1N5423: length 15.1
  Top Layer w0.254: H24.2 36.36,30.35 H39.1
  Bottom Layer w0.254: H24.1 H24.2 H24.3 H24.4
$1N5428: length 63.6
  Top Layer w0.254: v1(54.54,16.59) 59.57,21.63 62.58,21.63 ; 62.58,21.63 62.58,13.86 ; 62.58,21.63 68.49,21.63 SW4.5
  Bottom Layer w0.254: SW8.5 33.14,16.59 v1(54.54,16.59)
$1N5435: length 15.2
  Top Layer w0.254: 62.58,11.32 62.58,5.51 61.31,4.24
  Bottom Layer w0.254: 66.39,4.24 58.77,4.24
$1N5440: length 63.6
  Top Layer w0.254: 49.47,21.63 49.47,13.86
  Bottom Layer w0.254: SW4.6 70.22,17.36 55.81,17.36 51.54,21.63 47.12,21.63 42.73,17.23 31.24,17.23 SW8.6
$1N5447: length 15.2
  Top Layer w0.254: 48.2,4.24 49.47,5.51 49.47,11.32
  Bottom Layer w0.254: 53.28,4.24 45.66,4.24
$1N5451: length 63.6
  Top Layer w0.254: v1(44.38,15.58) 38.33,21.63 36.36,21.63 ; SW8.7 33.09,21.63 36.36,21.63 ; 36.36,21.63 36.36,13.86
  Bottom Layer w0.254: SW4.7 69.46,15.58 v1(44.38,15.58)
$1N5611: length 7.6
  Bottom Layer w0.254: 81.33,89.37 SW1.2 SW1.3 81.33,81.75
$1N5632: length 7.6
  Bottom Layer w0.254: 81.33,58.63 SW2.3 SW2.2 81.33,66.25
$1N5654: length 7.6
  Bottom Layer w0.254: 81.33,41.11 SW3.2 SW3.3 81.33,33.49
$1N5702: length 80.2
  Top Layer w0.254: SW4.8 73.71,9.66 72.54,10.83 72.54,11.81 73.23,12.5 73.53,12.5 73.71,12.68 74.2,12.68 74.89,13.37 74.89,16.89 73.71,18.07 SW3.8 73.71,34.36 72.54,35.54 72.54,39.06 73.23,39.75 73.53,39.75 73.71,39.93 74.2,39.93 74.89,40.62 74.89,41.6 73.71,42.78 SW2.8 73.71,59.58 72.54,60.76 72.54,64.27 73.23,64.96 73.53,64.96 73.71,65.15 74.2,65.15 74.89,65.84 74.89,66.81 73.71,67.99 SW1.8
$1N5734: length 7.6
  Bottom Layer w0.254: 81.33,16.21 SW4.2 SW4.3 81.33,8.59
$1N8243: length 8.7
  Bottom Layer w0.254: 17.71,90.51 SW5.4 SW5.3 SW5.2 SW5.1
$1N8264: length 7.6
  Bottom Layer w0.254: 17.71,59.27 SW6.2 SW6.3 17.71,66.89
$1N8286: length 7.6
  Bottom Layer w0.254: 17.71,33.23 SW7.2 SW7.3 17.71,40.85
$1N8697: length 7.6
  Bottom Layer w0.254: 17.71,16.21 SW8.3 SW8.2 17.71,8.59
$1N8799: length 84.6
  Top Layer w0.254: SW5.8 25.33,88.51 24.15,87.33 24.15,86.35 24.84,85.66 25.15,85.66 25.33,85.48 25.82,85.48 26.51,84.79 26.51,83.81 25.82,83.12 25.51,83.12 25.33,82.94 24.84,82.94 24.15,82.25 24.15,81.27 25.33,80.09 SW6.8 25.33,65.45 24.15,64.27 24.15,63.3 24.84,62.61 25.15,62.61 25.33,62.42 25.82,62.42 26.51,61.73 26.51,60.76 25.82,60.07 25.51,60.07 25.33,59.88 24.84,59.88 24.15,59.19 24.15,58.22 25.33,57.04 SW7.8 25.33,40.24 24.15,39.06 24.15,38.08 24.84,37.39 25.15,37.39 25.33,37.21 25.82,37.21 26.51,36.52 26.51,35.54 25.82,34.85 25.51,34.85 25.33,34.67 24.84,34.67 24.15,33.98 24.15,33 25.33,31.82 SW8.8

## Copper pours and planes (outline as drawn; the poured copper is in the pictures)
GND on Bottom Layer: 2.95,97.05 97.32,97.05 97.32,2.94 2.95,2.94

## Text on the board
Bottom Silkscreen Layer: github.com/OrigamiShido | Designed by Origami Shido
Top Silkscreen Layer: PORT2-2 | PORT1-3 | PORT3-3 | PORT4-3 | PORT1-2 | PORT3-2 | PORT4-2 | PORT1-1 | PORT2-1 | PORT3-1 | PORT4-1 | Channel 1 | Channel 2 | Switch 1-3: Port Connect / Switch 4: Group Connect
